# EAGLE design ft232 (EAGLE 7.3.0)
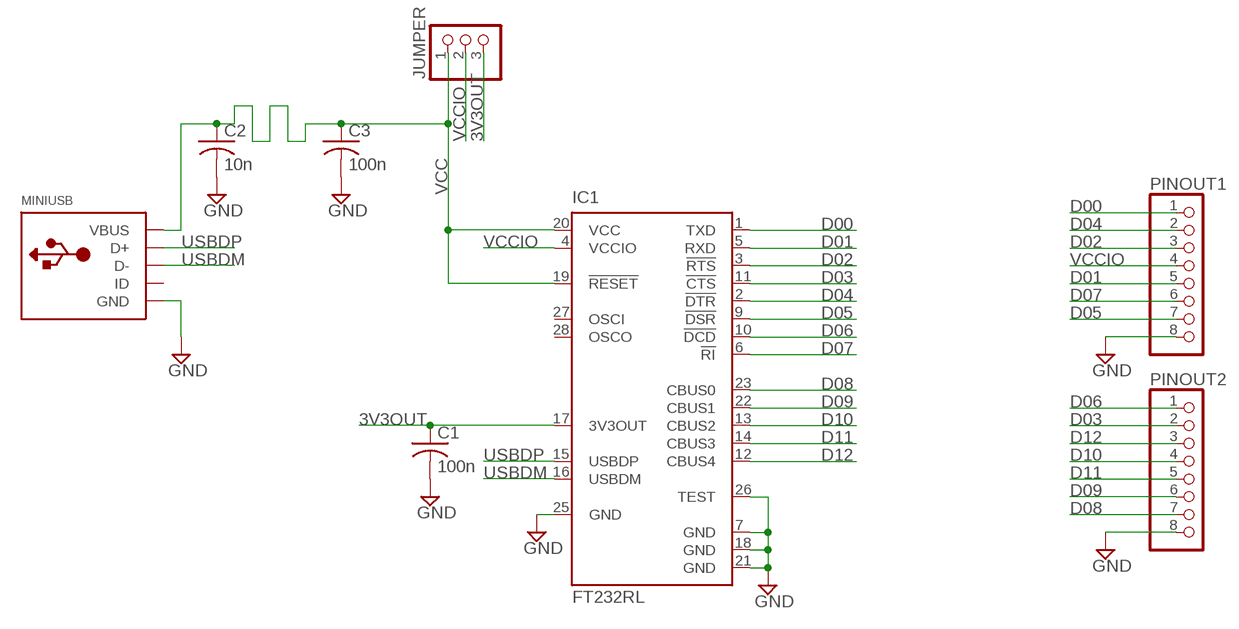
[diagram p0: schematic, sheet 1]

## Parts
C1  100n  C-USC0805  [C0805]
C2  10n  C-USC0805  [C0805]
C3  100n  C-USC0805  [C0805]
IC1  FT232RL  [SSOP28]
JUMPER  PINHD-1X3CB  [1X03-CLEANBIG]
MINIUSB  USBMINIB  [USB-MINIB]
PINOUT1  PINHD-1X8  [1X08]
PINOUT2  PINHD-1X8  [1X08]

## Nets
3V3OUT: C1.1 IC1.17(3V3OUT) JUMPER.3
D00: IC1.1(TXD) PINOUT1.1
D01: IC1.5(RXD) PINOUT1.5
D02: IC1.3(!RTS) PINOUT1.3
D03: IC1.11(!CTS) PINOUT2.2
D04: IC1.2(!DTR) PINOUT1.2
D05: IC1.9(!DSR) PINOUT1.7
D06: IC1.10(!DCD) PINOUT2.1
D07: IC1.6(!RI) PINOUT1.6
D08: IC1.23(CBUS0) PINOUT2.7
D09: IC1.22(CBUS1) PINOUT2.6
D10: IC1.13(CBUS2) PINOUT2.4
D11: IC1.14(CBUS3) PINOUT2.5
D12: IC1.12(CBUS4) PINOUT2.3
GND: C1.2 C2.2 C3.2 IC1.7(GND) IC1.18(GND) IC1.21(GND) IC1.25(GND) IC1.26(TEST) MINIUSB.GND PINOUT1.8 PINOUT2.8
USBDM: IC1.16(USBDM) MINIUSB.D-
USBDP: IC1.15(USBDP) MINIUSB.D+
VCC: C2.1 C3.1 IC1.19(!RESET) IC1.20(VCC) JUMPER.1 MINIUSB.VBUS
VCCIO: IC1.4(VCCIO) JUMPER.2 PINOUT1.4
Unconnected: IC1.27(OSCI) IC1.28(OSCO) MINIUSB.ID

## Library data of the parts
C1-C3 = adafruit:C-US: CAPACITOR, American symbol
IC1 = ftdichip:FT232R: Source: http://www.ftdichip.com/Documents/DataSheets/DS_FT232R_v104.pdf; MPN: FT232RL; OC_FARNELL: 1146032; OC_NEWARK: 91K9918
JUMPER = adafruit:PINHD-1X3: PIN HEADER
MINIUSB = adafruit:USB: USB Connectors USBMINIB - Surface Mount Female Mini-B USB Connector 4UConnector: 06564 By microbuilder.eu Thru-hole RA Female Mini-B USB Connector 4UConnector: 18732 By ladyada.net
PINOUT1 PINOUT2 = pinhead:PINHD-1X8: PIN HEADER

## Net classes
0 default: width 0.305 mm, drill 0.508 mm, clearance 0.127 mm

## Board
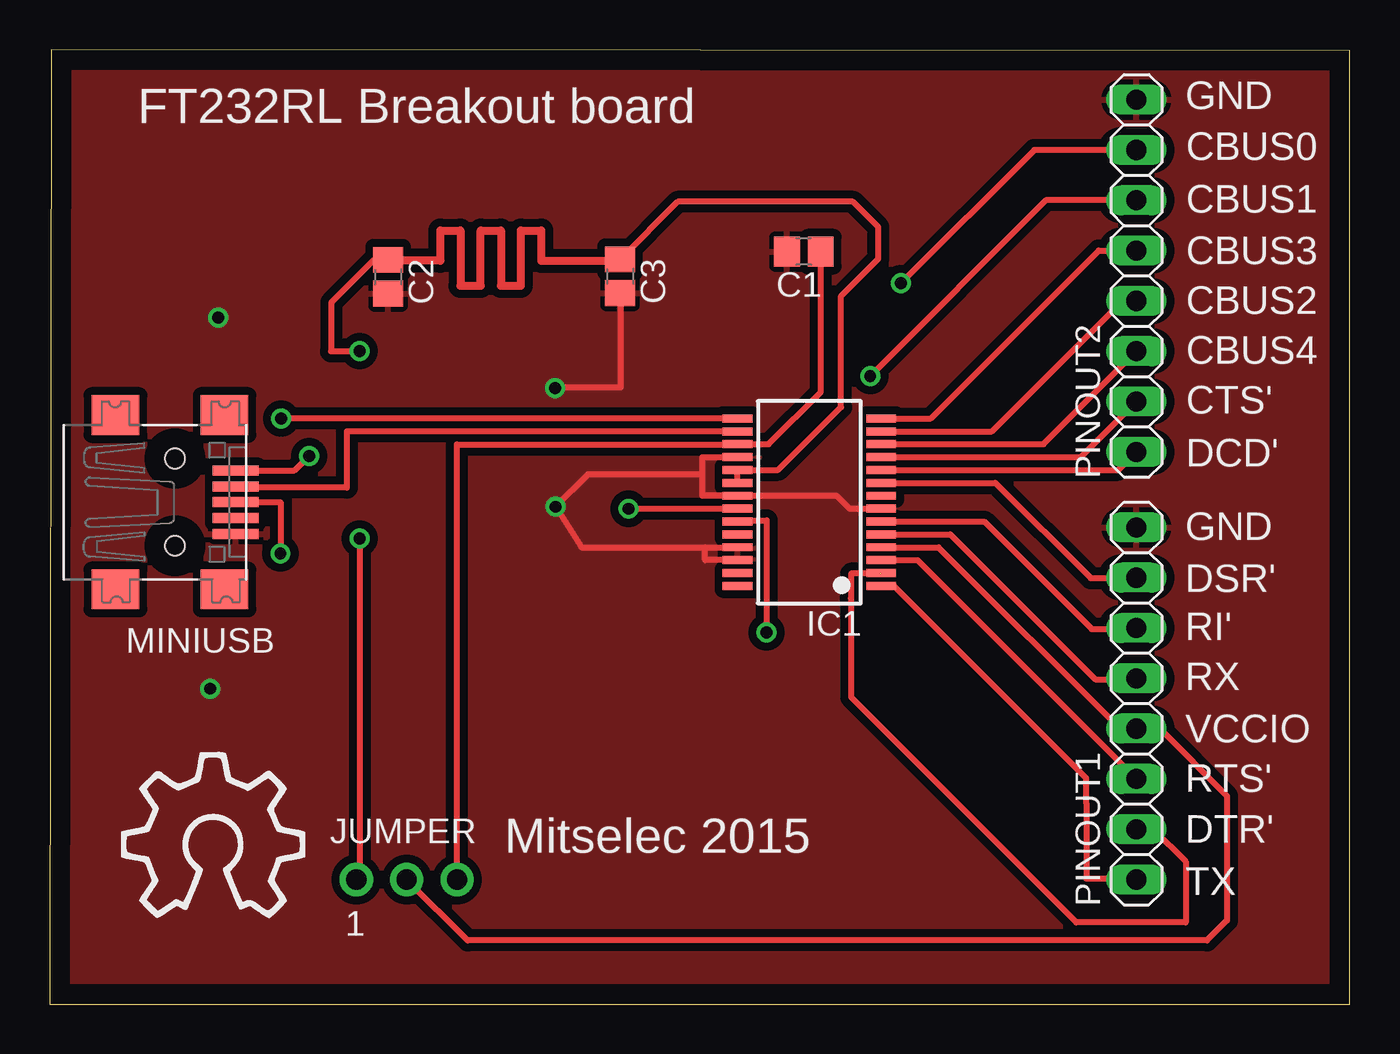
[diagram p1: board, top side]
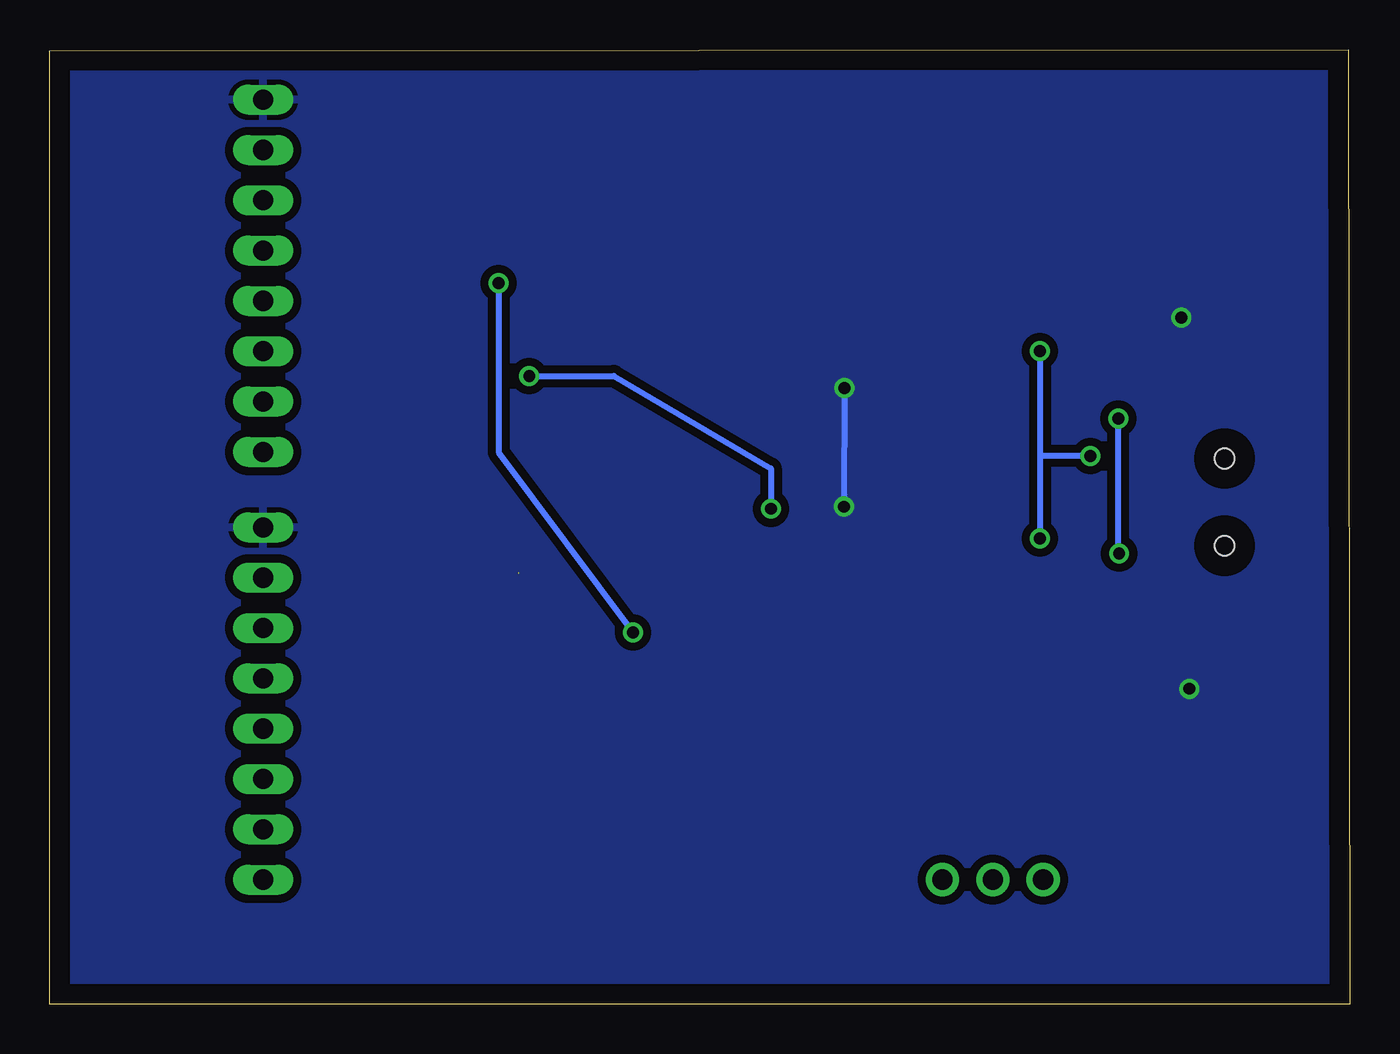
[diagram p2: board, bottom side, seen from below]

Size 65.64 x 48.2 mm. Coordinates in mm from the lower left corner, seen from the top.
Outline: 0,0 65.64,0.01 65.63,48.15 0.08,48.2 0,0
Copper layers (1*16): Top 0.035mm / dielectric 1.5mm / Bottom 0.035mm
Design rules "default *": minimum track width 10mil, minimum drill 0.4096mm, track to track 8mil, track to pad 8mil, pad to pad 8mil, via to via 8mil, smd to smd 8mil, copper to edge 40mil, drill to drill 8mil, minimum pad ring 10mil, minimum via ring 8mil, stop-mask expansion 4mil, vias tented up to drill 0mil, thermal gap 10mil

### Footprints (pad centres in the part's own frame; a part is rotated, then mirrored left to right if it is on the bottom)
C0805 = smd 1.3 x 1.5: 1 -0.85,0; 2 0.85,0
SSOP28 = smd 0.4 x 1.5: 1 -4.225,-3.625; 2 -3.575,-3.625; 3 -2.925,-3.625; 4 -2.275,-3.625; 5 -1.625,-3.625; 6 -0.975,-3.625; 7 -0.325,-3.625; 8 0.325,-3.625; 9 0.975,-3.625; 10 1.625,-3.625; 11 2.275,-3.625; 12 2.925,-3.625; 13 3.575,-3.625; 14 4.225,-3.625; 15 4.225,3.625; 16 3.575,3.625; 17 2.925,3.625; 18 2.275,3.625; 19 1.625,3.625; 20 0.975,3.625; 21 0.325,3.625; 22 -0.325,3.625; 23 -0.975,3.625; 24 -1.625,3.625; 25 -2.275,3.625; 26 -2.925,3.625; 27 -3.575,3.625; 28 -4.225,3.625
1X03-CLEANBIG = drill 1.016 pad 1.676: 1 -2.54,0; 2 0,0; 3 2.54,0
USB-MINIB = smd 0.5 x 2.308: D+ 0,4.064; D- -0.8,4.064; GND 1.6,4.064; ID 0.8,4.064; VBUS -1.6,4.064 | smd 2 x 2.4: GND1 -4.4,-2; GND2 -4.4,3.5; GND3 4.4,3.5; GND4 4.4,-2 | hole 1: -2.2,1; 2.2,1
1X08 = drill 1.016 long: 1 -8.89,0; 2 -6.35,0; 3 -3.81,0; 4 -1.27,0; 5 1.27,0; 6 3.81,0; 7 6.35,0; 8 8.89,0

### Placement (x,y rotation side)
C1  38.07,38 180 top
C2  17.09,36.73 270 top
C3  28.8,36.75 270 top
IC1  38.35,25.35 90 top
JUMPER  18.03,6.3 0 top
MINIUSB  5.33,25.35 270 top
PINOUT1  54.86,15.19 90 top
PINOUT2  54.86,36.78 90 top

### Tracks (layer width: path | path; a pad name or v marks a point on that pad's centre or on a via)
3V3OUT
  Top 0.305: C1.1 38.93,37.98 38.93,30.91 36.3,28.27 IC1.17 20.57,28.27 JUMPER.3
D00
  Top 0.305: 54.81,6.35 52.32,6.35 52.32,10.16 52.32,11.43 42.62,21.12 IC1.1
  Top 0.406: 54.81,6.35 PINOUT1.1
D01
  Top 0.305: IC1.5 45.46,23.72 52.78,16.41 54.81,16.41
  Top 0.406: 54.81,16.41 PINOUT1.5
D02
  Top 0.305: IC1.3 43.81,22.42 PINOUT1.3
D03
  Top 0.305: IC1.11 52.05,27.62 PINOUT2.2
D04  (1 unrouted)
  Top 0.305: 55.72,8.84 57.35,7.21 57.35,4.14 51.81,4.14 51.81,4.17 40.46,15.52 40.46,20.5 | 40.43,20.5 40.46,20.5 | 41.94,21.74 40.46,21.74 40.46,20.5
  Top 0.406: PINOUT1.2 55.72,8.84
D05
  Top 0.305: IC1.9 47.74,26.32 52.55,21.51 54.83,21.51
  Top 0.406: 54.83,21.51 PINOUT1.7
D06
  Top 0.305: IC1.10 53.94,26.97 PINOUT2.1
D07
  Top 0.305: IC1.6 47.17,24.37 52.6,18.95 54.81,18.95
  Top 0.406: 54.81,18.95 PINOUT1.6
D08  (via drill 0.6)
  Top 0.305: PINOUT2.7 49.7,43.13 v42.97,36.4 | IC1.23 34.78,24.43 36.19,24.43 v36.18,18.77
  Bottom 0.305: v42.97,36.4 42.97,27.86 v36.18,18.77
D09  (via drill 0.6)
  Top 0.305: PINOUT2.6 50.29,40.59 v41.42,31.72 | v29.23,25.02 IC1.22
  Bottom 0.305: v41.42,31.72 37.16,31.72 29.23,27.05 v29.23,25.02
D10
  Top 0.305: IC1.13 47.56,28.92 54.05,35.41 54.76,35.41
  Top 0.406: 54.76,35.41 PINOUT2.4
D11
  Top 0.305: IC1.14 44.48,29.57 52.95,38.05 PINOUT2.5
D12
  Top 0.305: IC1.12 50.16,28.27 PINOUT2.3
GND  (via drill 0.6)
  Top 0.305: IC1.18 34.71,27.61 32.94,27.61 32.94,26.75 | IC1.21 39.73,25.67 40.38,25.02 IC1.7 | IC1.25 34.71,23.06 33.09,23.06 | 29.28,35.85 C3.2 28.83,35.9 28.83,31.14 25.52,31.14 v25.52,31.12 | 33.09,23.06 26.84,23.06 v25.55,25.12 27.17,26.75 32.94,26.75 | 32.94,26.75 32.94,25.68 | 32.94,25.68 IC1.21 | IC1.21 32.94,25.67 32.94,25.68 | IC1.26 33.09,22.42 33.09,23.06
  Bottom 0.305: v25.52,31.12 v25.55,25.12
  other vias: 8.51,34.66 8.11,15.93
  pour Top (isolate 0.406): -1.02,50.8 -1.02,-4.52 69.49,-4.52 69.49,50.8
  pour Bottom (isolate 0.406): -4.35,51.84 -4.35,-4.55 70.81,-5.03 70.81,51.35
USBDM
  Top 0.305: IC1.16 15.01,28.92 15.01,26.09 9.39,26.09 MINIUSB.D-
USBDP  (via drill 0.6)
  Top 0.305: IC1.15 v11.69,29.57 | MINIUSB.D+ 11.65,25.35 v11.65,22.76
  Bottom 0.305: v11.65,22.76 11.69,22.76 v11.69,29.57
VCC  (via drill 0.6)
  Top 0.305: 28.77,37.58 C3.1 31.71,40.51 40.56,40.51 41.83,39.24 41.83,37.64 39.95,35.76 39.95,30.15 36.77,26.97 IC1.19 IC1.20 | C2.1 16.36,37.58 14.22,35.43 14.22,32.99 14.19,32.97 v15.64,32.97 | v15.64,23.52 15.64,6.45 JUMPER.1 | MINIUSB.VBUS 12.36,26.95 v13.1,27.69
  Top 0.406: C2.1 19.73,37.58 | 19.73,37.58 19.73,37.54 | 19.73,37.58 19.73,39.07 20.75,39.07 20.75,36.27 21.76,36.27 21.76,39.07 22.78,39.07 22.78,36.27 23.79,36.27 23.79,39.07 24.81,39.07 24.81,37.54 28.8,37.54 C3.1
  Bottom 0.305: v15.64,32.97 15.64,27.69 | 15.64,27.69 v15.64,23.52 | v13.1,27.69 15.64,27.69
VCCIO
  Top 0.305: 56.03,13.92 59.43,10.52 59.43,4.24 58.41,3.23 21.1,3.23 JUMPER.2 | IC1.4 44.87,23.07 54.07,13.87 54.81,13.87 PINOUT1.4
  Top 0.406: 54.76,13.82 PINOUT1.4 56.03,13.92

### Text on the board
tPlace: GND | FT232RL Breakout board | CBUS0 | CBUS1 | CBUS3 | CBUS2 | CBUS4 | CTS' | DCD' | GND | DSR' | RI' | RX | VCCIO | RTS' | Mitselec 2015 | DTR' | TX | 1